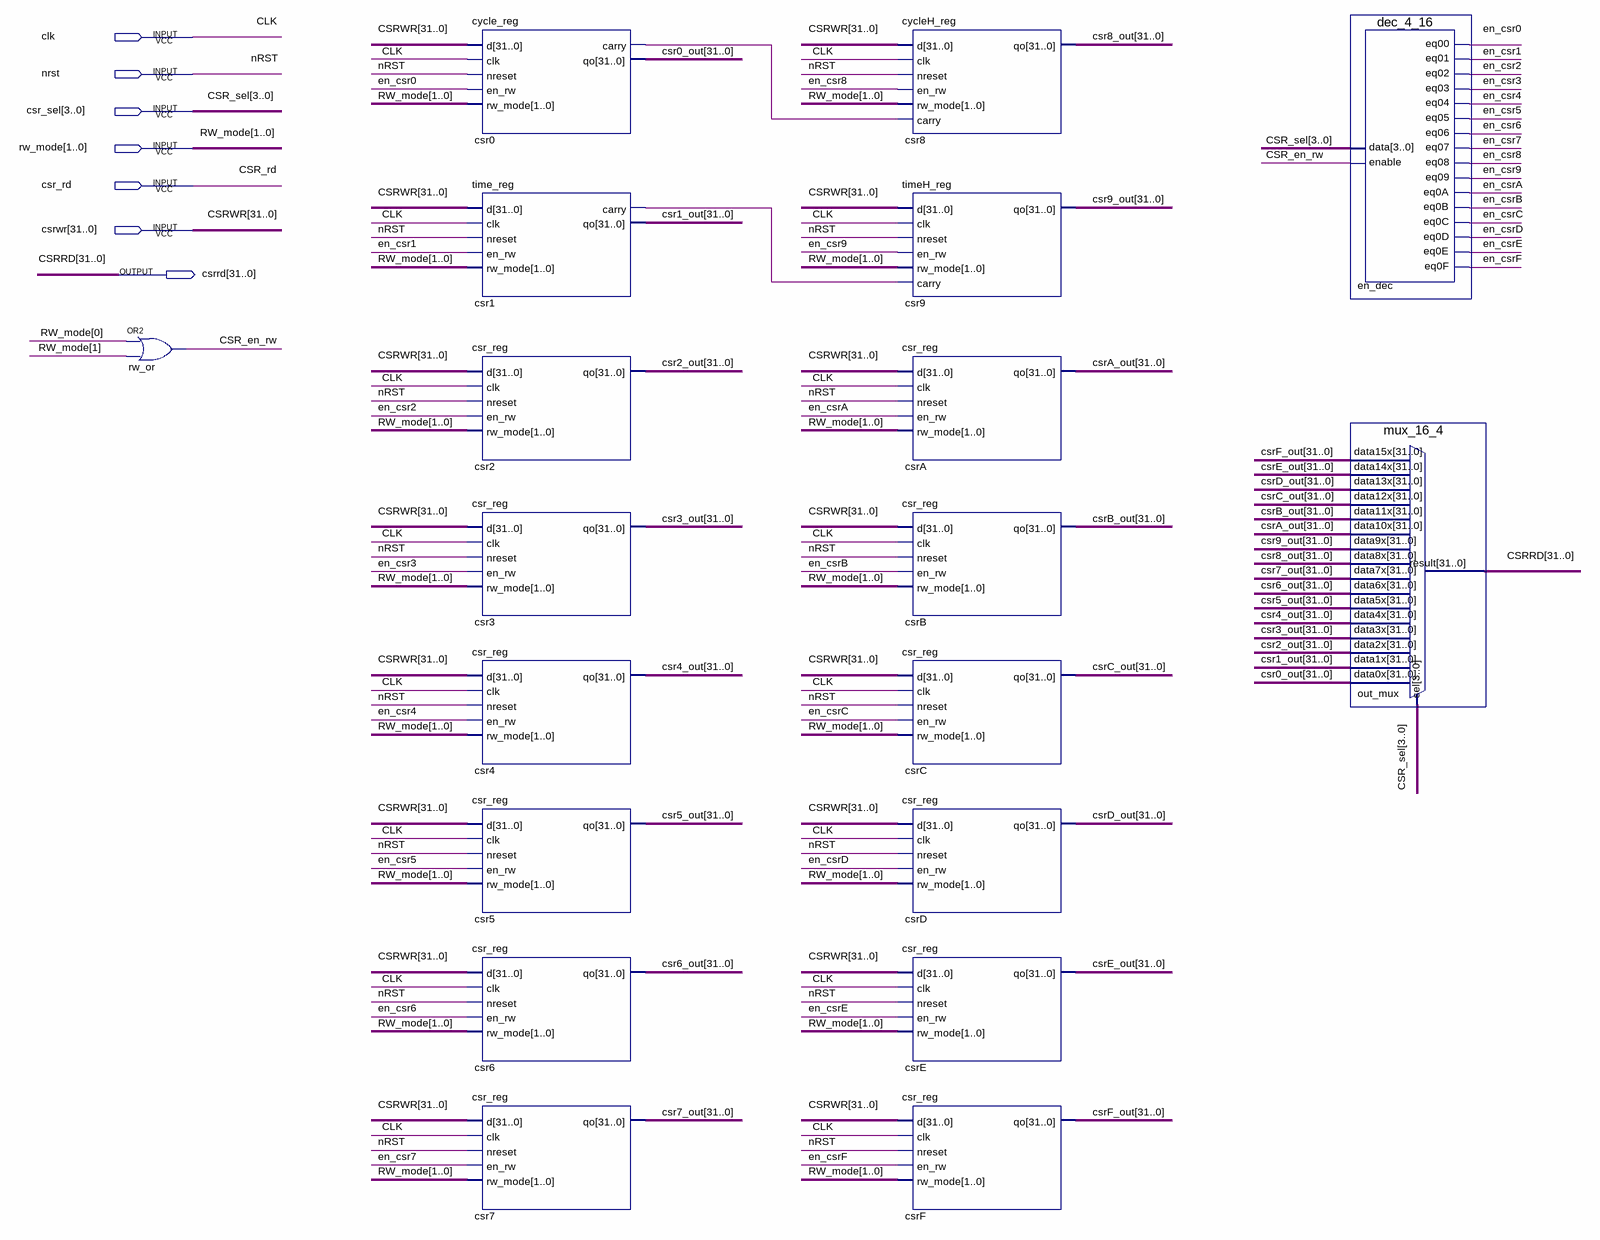
[diagram p0: schematic sheet]
// Quartus schematic csr_regbank.bdf as structural Verilog: 19 symbols, 7 pins
module csr_regbank (
  input  clk,
  input  nrst,
  input  [3:0] csr_sel,
  input  [1:0] rw_mode,
  input  csr_rd,
  input  [31:0] csrwr,
  output [31:0] csrrd
);

  wire csr0_carry, csr1_carry, CSR_en_rw, en_csr0, en_csr1, en_csr2, en_csr3, en_csr4, en_csr5, en_csr6,
       en_csr7, en_csr8, en_csr9, en_csrA, en_csrB, en_csrC, en_csrD, en_csrE, en_csrF;
  wire [31:0] csr0_out, csr1_out, csr2_out, csr3_out, csr4_out, csr5_out, csr6_out, csr7_out, csr8_out,
       csr9_out, csrA_out, csrB_out, csrC_out, csrD_out, csrE_out, csrF_out;

  or rw_or (CSR_en_rw, rw_mode[0], rw_mode[1]);
  cycle_reg csr0 (
    .d(csrwr), .clk(clk), .nreset(nrst), .en_rw(en_csr0), .rw_mode(rw_mode), .carry(csr0_carry), .qo(csr0_out));
  time_reg csr1 (
    .d(csrwr), .clk(clk), .nreset(nrst), .en_rw(en_csr1), .rw_mode(rw_mode), .carry(csr1_carry), .qo(csr1_out));
  csr_reg csr2 (.d(csrwr), .clk(clk), .nreset(nrst), .en_rw(en_csr2), .rw_mode(rw_mode), .qo(csr2_out));
  csr_reg csr3 (.d(csrwr), .clk(clk), .nreset(nrst), .en_rw(en_csr3), .rw_mode(rw_mode), .qo(csr3_out));
  csr_reg csr4 (.d(csrwr), .clk(clk), .nreset(nrst), .en_rw(en_csr4), .rw_mode(rw_mode), .qo(csr4_out));
  csr_reg csr5 (.d(csrwr), .clk(clk), .nreset(nrst), .en_rw(en_csr5), .rw_mode(rw_mode), .qo(csr5_out));
  csr_reg csr6 (.d(csrwr), .clk(clk), .nreset(nrst), .en_rw(en_csr6), .rw_mode(rw_mode), .qo(csr6_out));
  csr_reg csr7 (.d(csrwr), .clk(clk), .nreset(nrst), .en_rw(en_csr7), .rw_mode(rw_mode), .qo(csr7_out));
  cycleH_reg csr8 (
    .d(csrwr), .clk(clk), .nreset(nrst), .en_rw(en_csr8), .rw_mode(rw_mode), .carry(csr0_carry), .qo(csr8_out));
  timeH_reg csr9 (
    .d(csrwr), .clk(clk), .nreset(nrst), .en_rw(en_csr9), .rw_mode(rw_mode), .carry(csr1_carry), .qo(csr9_out));
  csr_reg csrA (.d(csrwr), .clk(clk), .nreset(nrst), .en_rw(en_csrA), .rw_mode(rw_mode), .qo(csrA_out));
  csr_reg csrB (.d(csrwr), .clk(clk), .nreset(nrst), .en_rw(en_csrB), .rw_mode(rw_mode), .qo(csrB_out));
  csr_reg csrC (.d(csrwr), .clk(clk), .nreset(nrst), .en_rw(en_csrC), .rw_mode(rw_mode), .qo(csrC_out));
  csr_reg csrD (.d(csrwr), .clk(clk), .nreset(nrst), .en_rw(en_csrD), .rw_mode(rw_mode), .qo(csrD_out));
  csr_reg csrE (.d(csrwr), .clk(clk), .nreset(nrst), .en_rw(en_csrE), .rw_mode(rw_mode), .qo(csrE_out));
  csr_reg csrF (.d(csrwr), .clk(clk), .nreset(nrst), .en_rw(en_csrF), .rw_mode(rw_mode), .qo(csrF_out));
  dec_4_16 en_dec (
    .data(csr_sel), .enable(CSR_en_rw), .eq00(en_csr0), .eq01(en_csr1), .eq02(en_csr2), .eq03(en_csr3),
    .eq04(en_csr4), .eq05(en_csr5), .eq06(en_csr6), .eq07(en_csr7), .eq08(en_csr8), .eq09(en_csr9),
    .eq0A(en_csrA), .eq0B(en_csrB), .eq0C(en_csrC), .eq0D(en_csrD), .eq0E(en_csrE), .eq0F(en_csrF));
  mux_16_4 out_mux (
    .data15x(csrF_out), .data14x(csrE_out), .data13x(csrD_out), .data12x(csrC_out), .data11x(csrB_out),
    .data10x(csrA_out), .data9x(csr9_out), .data8x(csr8_out), .data7x(csr7_out), .data6x(csr6_out),
    .data5x(csr5_out), .data4x(csr4_out), .data3x(csr3_out), .data2x(csr2_out), .data1x(csr1_out),
    .data0x(csr0_out), .sel(csr_sel), .result(csrrd));
endmodule
